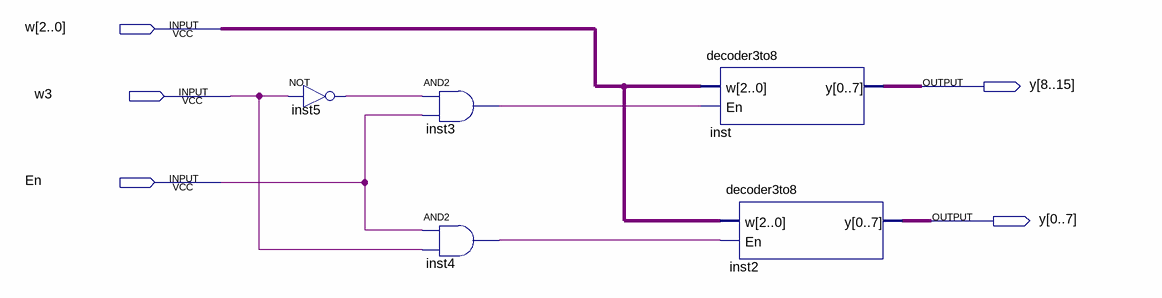
[diagram p0: schematic sheet]
// Quartus schematic dec4to16.bdf as structural Verilog: 5 symbols, 5 pins
module dec4to16 (
  input  [2:0] w,
  input  w3,
  input  En,
  output [0:15] y
);

  wire inst3_out, inst4_out, inst5_out;

  not inst5 (inst5_out, w3);
  and inst3 (inst3_out, inst5_out, En);
  and inst4 (inst4_out, En, w3);
  decoder3to8 inst (.w(w), .En(inst3_out), .y(y[8:15]));
  decoder3to8 inst2 (.w(w), .En(inst4_out), .y(y[0:7]));
endmodule
